# EAGLE schematic Control Board (EAGLE 7.7.0)
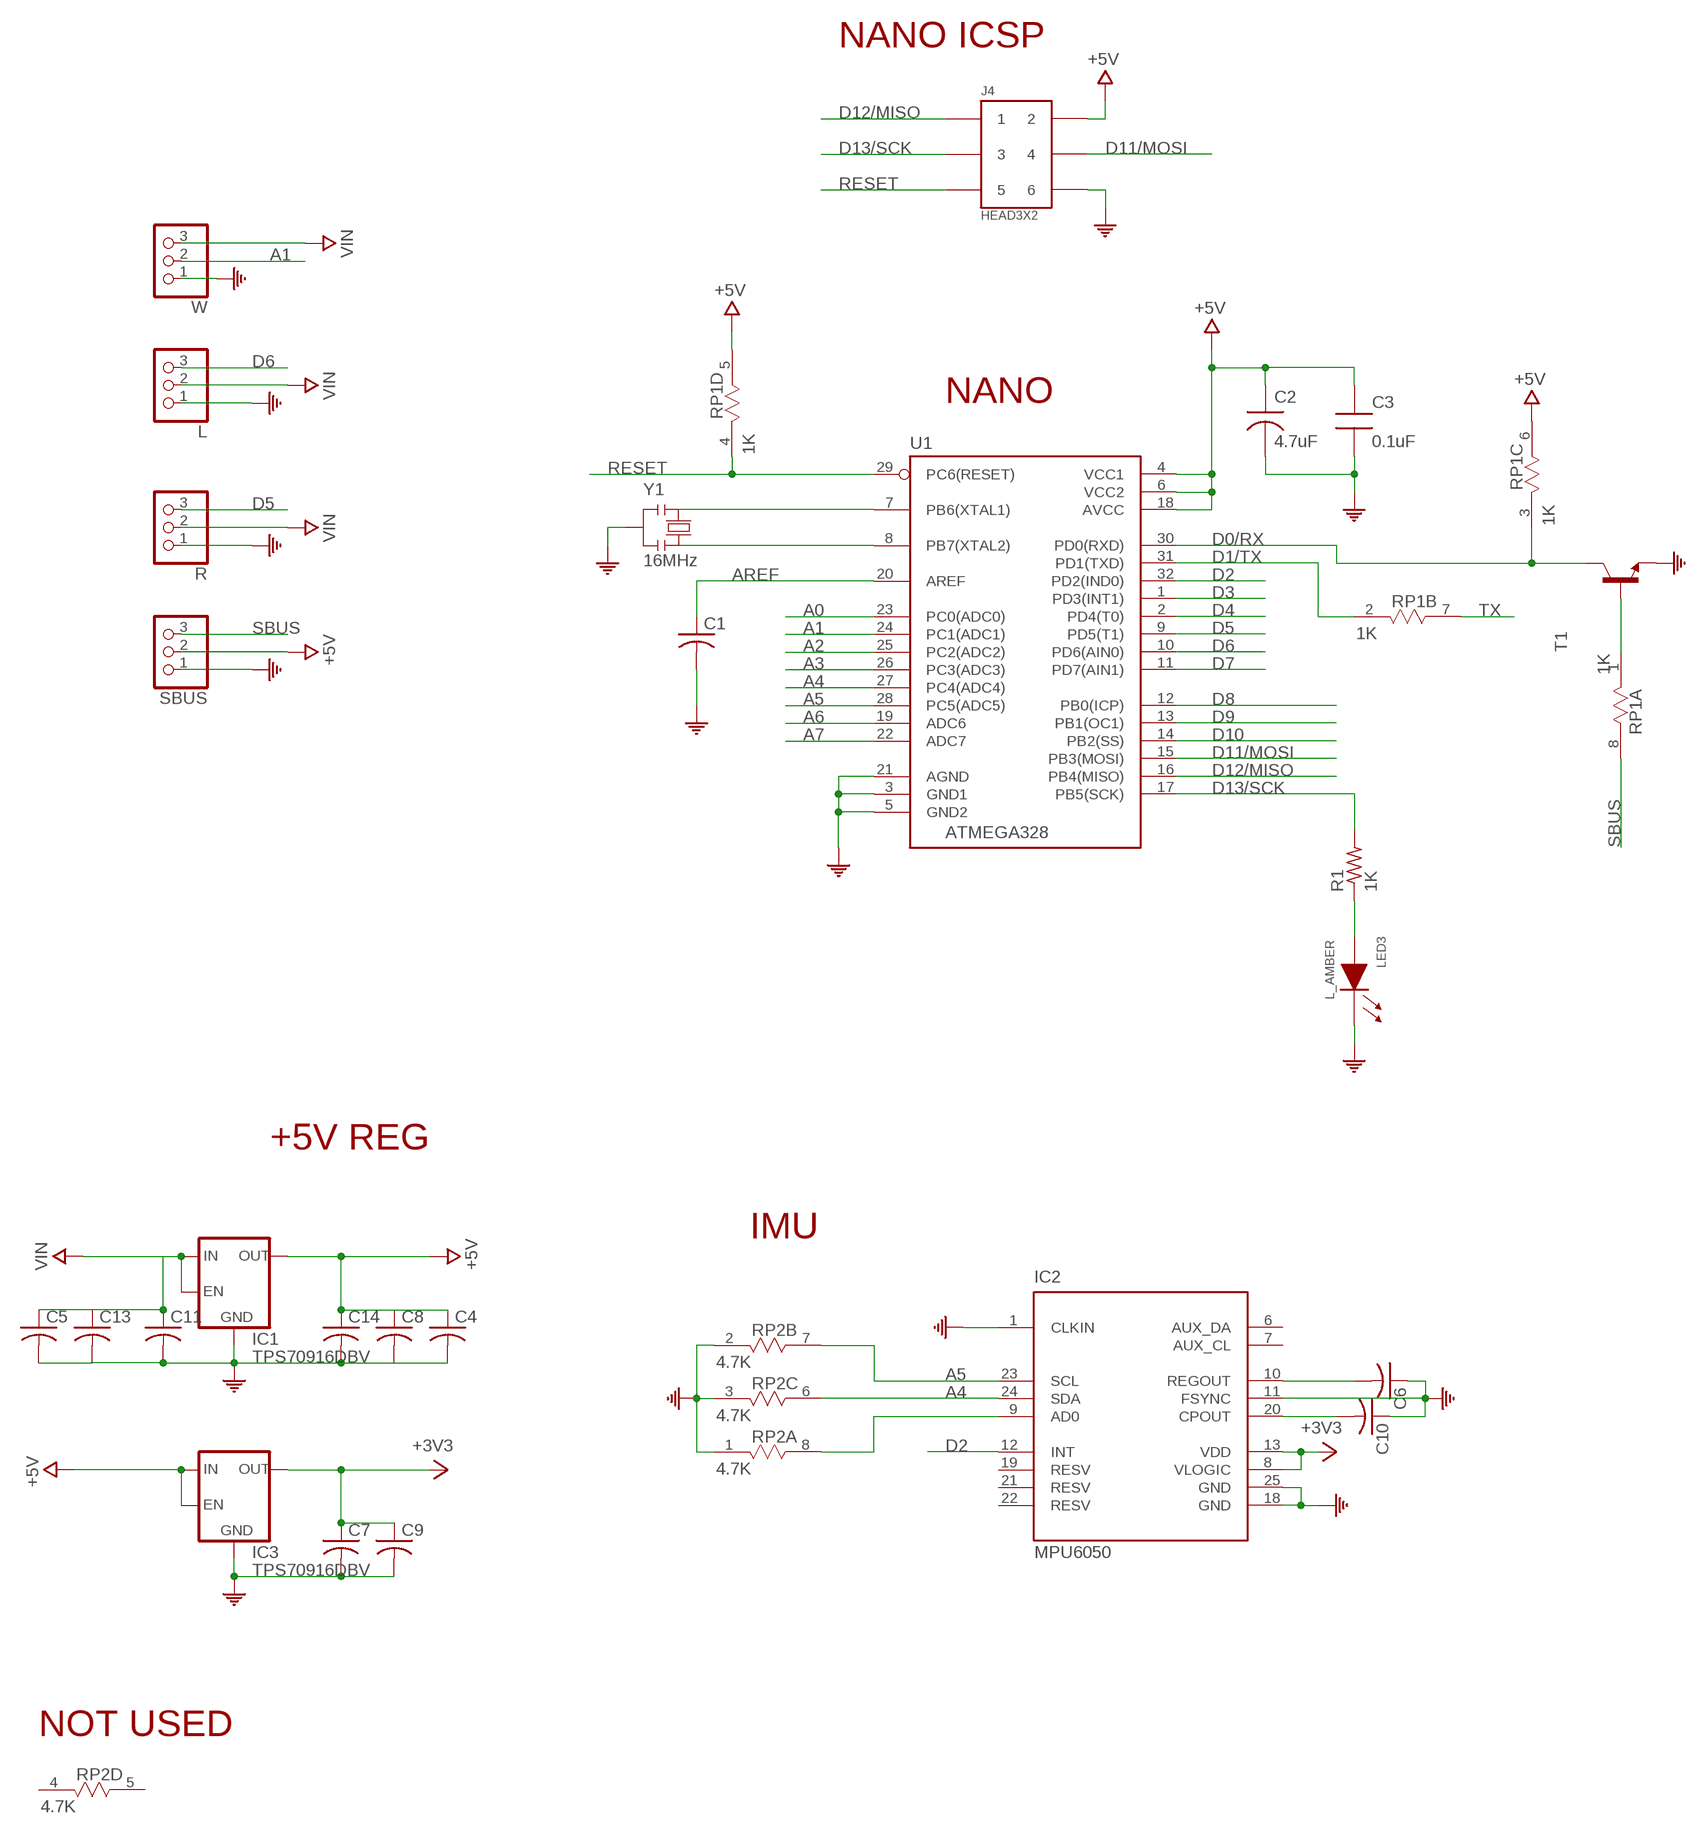
[diagram p0: schematic, sheet 1]

## Parts
C1  C-USC0603  [C0603]
C2  4.7uF  CAP-TANA-P  [TAN-A]
C3  0.1uF  CAP0805-NP  [CAP0805-NP]
C4  C-USC0603  [C0603]
C5  C-USC0603  [C0603]
C6  C-USC0603  [C0603]
C7  C-USC0603  [C0603]
C8  C-USC0603  [C0603]
C9  C-USC0603  [C0603]
C10  C-USC0603  [C0603]
C11  C-USC0603  [C0603]
C13  C-USC0603  [C0603]
C14  C-USC0603  [C0603]
IC1  TPS70916DBV  [SOT23-5]
IC2  MPU6050  [QFN50P400X400X95-25T265X275N]
IC3  TPS70916DBV  [SOT23-5]
J4  HEAD3X2  [HEAD3X2]
L  PINHD-1X3  [1X03]
LED3  L_AMBER  LED0805  [LED0805]
R  PINHD-1X3  [1X03]
R1  1K  R-US_R0603  [R0603]
RP1  1K  RES4NT  [RES4NT]
RP2  4.7K  RES4NT  [RES4NT]
SBUS  PINHD-1X3  [1X03]
T1  MMBT3904LT1-NPN-SOT23-BEC  [SOT23-BEC]
U1  ATMEGA328  ATMEGA168-20AU  [QFP032]
W  PINHD-1X3  [1X03]
Y1  16MHz  RESONATORMU  [RESONATOR]

## Nets
+3V3: C7.1 C9.1 IC2.8(VLOGIC) IC2.13(VDD) IC3.5(OUT)
+5V: C2.1 C3.1 C4.1 C8.1 C14.1 IC1.5(OUT) IC3.1(IN) IC3.3(EN) J4.2 RP1.5 RP1.6 SBUS.2 U1.4(VCC1) U1.6(VCC2) U1.18(AVCC)
A0: U1.23(PC0(ADC0))
A1: U1.24(PC1(ADC1)) W.2
A2: U1.25(PC2(ADC2))
A3: U1.26(PC3(ADC3))
A4: IC2.24(SDA) RP2.6 U1.27(PC4(ADC4))
A5: IC2.23(SCL) RP2.7 U1.28(PC5(ADC5))
A6: U1.19(ADC6)
A7: U1.22(ADC7)
AREF: C1.1 U1.20(AREF)
COM: C1.2 C2.2 C3.2 C4.2 C5.2 C6.1 C7.2 C8.2 C9.2 C10.1 C11.2 C13.2 C14.2 IC1.2(GND) IC2.1(CLKIN) IC2.11(FSYNC) IC2.18(GND) IC2.25(GND) IC3.2(GND) J4.6 L.1 LED3.1(CA) R.1 RP2.1 RP2.2 RP2.3 SBUS.1 T1.E U1.3(GND1) U1.5(GND2) U1.21(AGND) W.1 Y1.2
D0/RX: RP1.3 T1.C U1.30(PD0(RXD))
D1/TX: RP1.2 U1.31(PD1(TXD))
D2: IC2.12(INT) U1.32(PD2(IND0))
D3: U1.1(PD3(INT1))
D4: U1.2(PD4(T0))
D5: R.3 U1.9(PD5(T1))
D6: L.3 U1.10(PD6(AIN0))
D7: U1.11(PD7(AIN1))
D8: U1.12(PB0(ICP))
D9: U1.13(PB1(OC1))
D10: U1.14(PB2(SS))
D11/MOSI: J4.4 U1.15(PB3(MOSI))
D12/MISO: J4.1 U1.16(PB4(MISO))
D13/SCK: J4.3 R1.2 U1.17(PB5(SCK))
N$1: U1.8(PB7(XTAL2)) Y1.3
N$2: U1.7(PB6(XTAL1)) Y1.1
N$3: IC2.9(AD0) RP2.8
N$4: C6.2 IC2.10(REGOUT)
N$5: RP1.1 T1.B
N$6: C10.2 IC2.20(CPOUT)
N$7: LED3.2(AN) R1.1
RESET: J4.5 RP1.4 U1.29(PC6(RESET))
SBUS: RP1.8 SBUS.3
TX: RP1.7
VIN: C5.1 C11.1 C13.1 IC1.1(IN) IC1.3(EN) L.2 R.2 W.3
Unconnected: IC2.2(NC) IC2.3(NC) IC2.4(NC) IC2.5(NC) IC2.6(AUX_DA) IC2.7(AUX_CL) IC2.14(NC) IC2.15(NC) IC2.16(NC) IC2.17(NC) IC2.19(RESV) IC2.21(RESV) IC2.22(RESV) RP2.4 RP2.5

## Notes on the sheet
- NANO ICSP
- NANO
- +5V REG
- IMU
- NOT USED

## Library data of the parts
C1 C4-C11 C13 C14 = resistor:C-US: CAPACITOR, American symbol
C2 = MySMD:CAP-TANA-P
C3 = MySMD:CAP0805-NP
IC1 IC3 = tps709xx_10:TPS709*: TPS709xx 150-mA, 30-V, 1-μA IQ Voltage Regulators with Enable Source: http://www.ti.com/lit/ds/symlink/tps709.pdf; MF: Texas Instruments; MPN: TPS70916DBVT; OC_FARNELL: 2314371; OC_NEWARK: 69W6893
IC2 = invensense:MPU6050: The triple-axis MEMS gyroscope
J4 = MyCON2:HEAD3X2
L R SBUS W = pinhead:PINHD-1X3: PIN HEADER
LED3 = MySMD:LED0805
R1 = resistor:R-US_: RESISTOR, American symbol
RP1 RP2 = MySMD:RES4NT
T1 = transistor-neu-to92:*-NPN-: NPN Transistror
U1 = MySMD:ATMEGA168-20AU
Y1 = MySMD2:RESONATOR